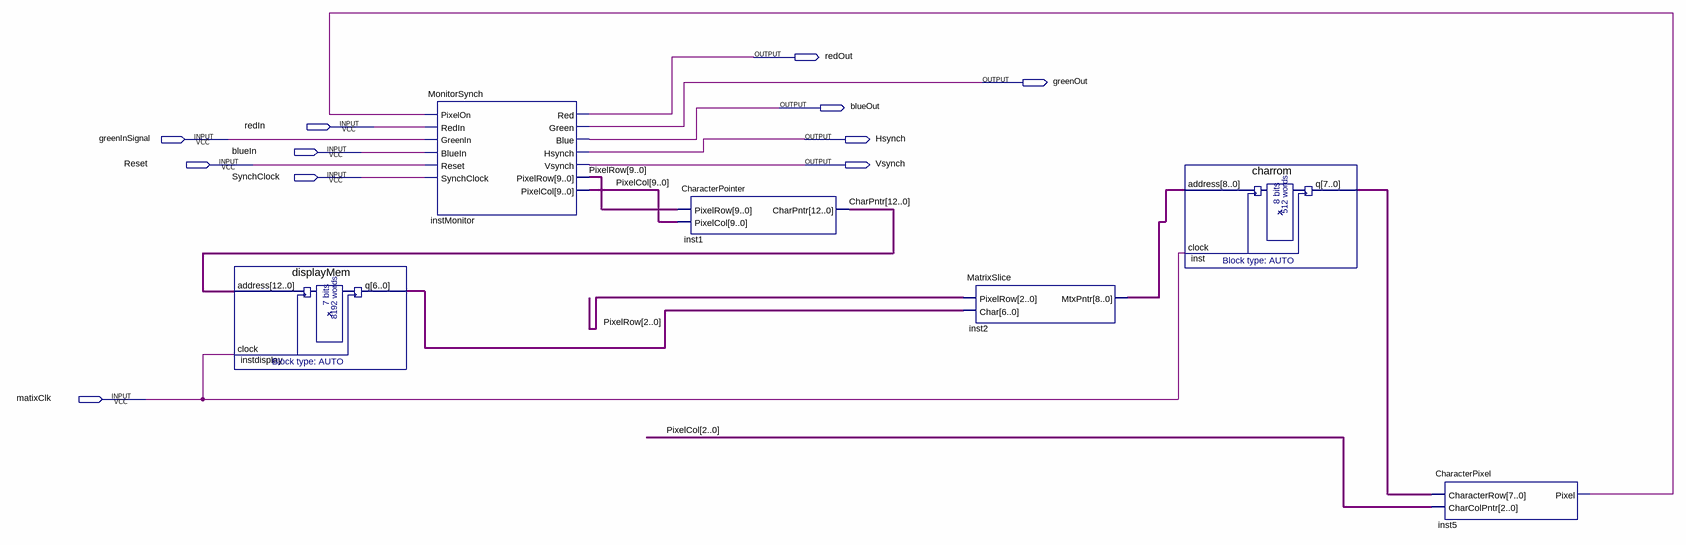
[diagram p0: schematic sheet]
// Quartus schematic lab5.bdf as structural Verilog: 6 symbols, 11 pins
module lab5 (
  input  redIn,
  input  greenInSignal,
  input  blueIn,
  input  Reset,
  input  SynchClock,
  input  matixClk,
  output redOut,
  output greenOut,
  output blueOut,
  output Hsynch,
  output Vsynch
);

  wire inst5_pixel;
  wire [6:0] instdisplay_q;
  wire [7:0] inst_q;
  wire [8:0] inst2_mtxpntr;
  wire [9:0] PixelCol, PixelRow;
  wire [12:0] CharPntr;

  displayMem instdisplay (.address(CharPntr), .clock(matixClk), .q(instdisplay_q));
  MonitorSynch instMonitor (
    .PixelOn(inst5_pixel), .RedIn(redIn), .GreenIn(greenInSignal), .BlueIn(blueIn), .Reset(Reset),
    .SynchClock(SynchClock), .Red(redOut), .Green(greenOut), .Blue(blueOut), .Hsynch(Hsynch),
    .Vsynch(Vsynch), .PixelRow(PixelRow), .PixelCol(PixelCol));
  CharacterPointer inst1 (.PixelRow(PixelRow), .PixelCol(PixelCol), .CharPntr(CharPntr));
  MatrixSlice inst2 (.PixelRow(PixelRow[2:0]), .Char(instdisplay_q), .MtxPntr(inst2_mtxpntr));
  charrom inst (.address(inst2_mtxpntr), .clock(matixClk), .q(inst_q));
  CharacterPixel inst5 (.CharacterRow(inst_q), .CharColPntr(PixelCol[2:0]), .Pixel(inst5_pixel));
endmodule
